# Altium schematic sheet Logic.SchDoc
size C; SheetNumber: 7; SheetTotal: 8
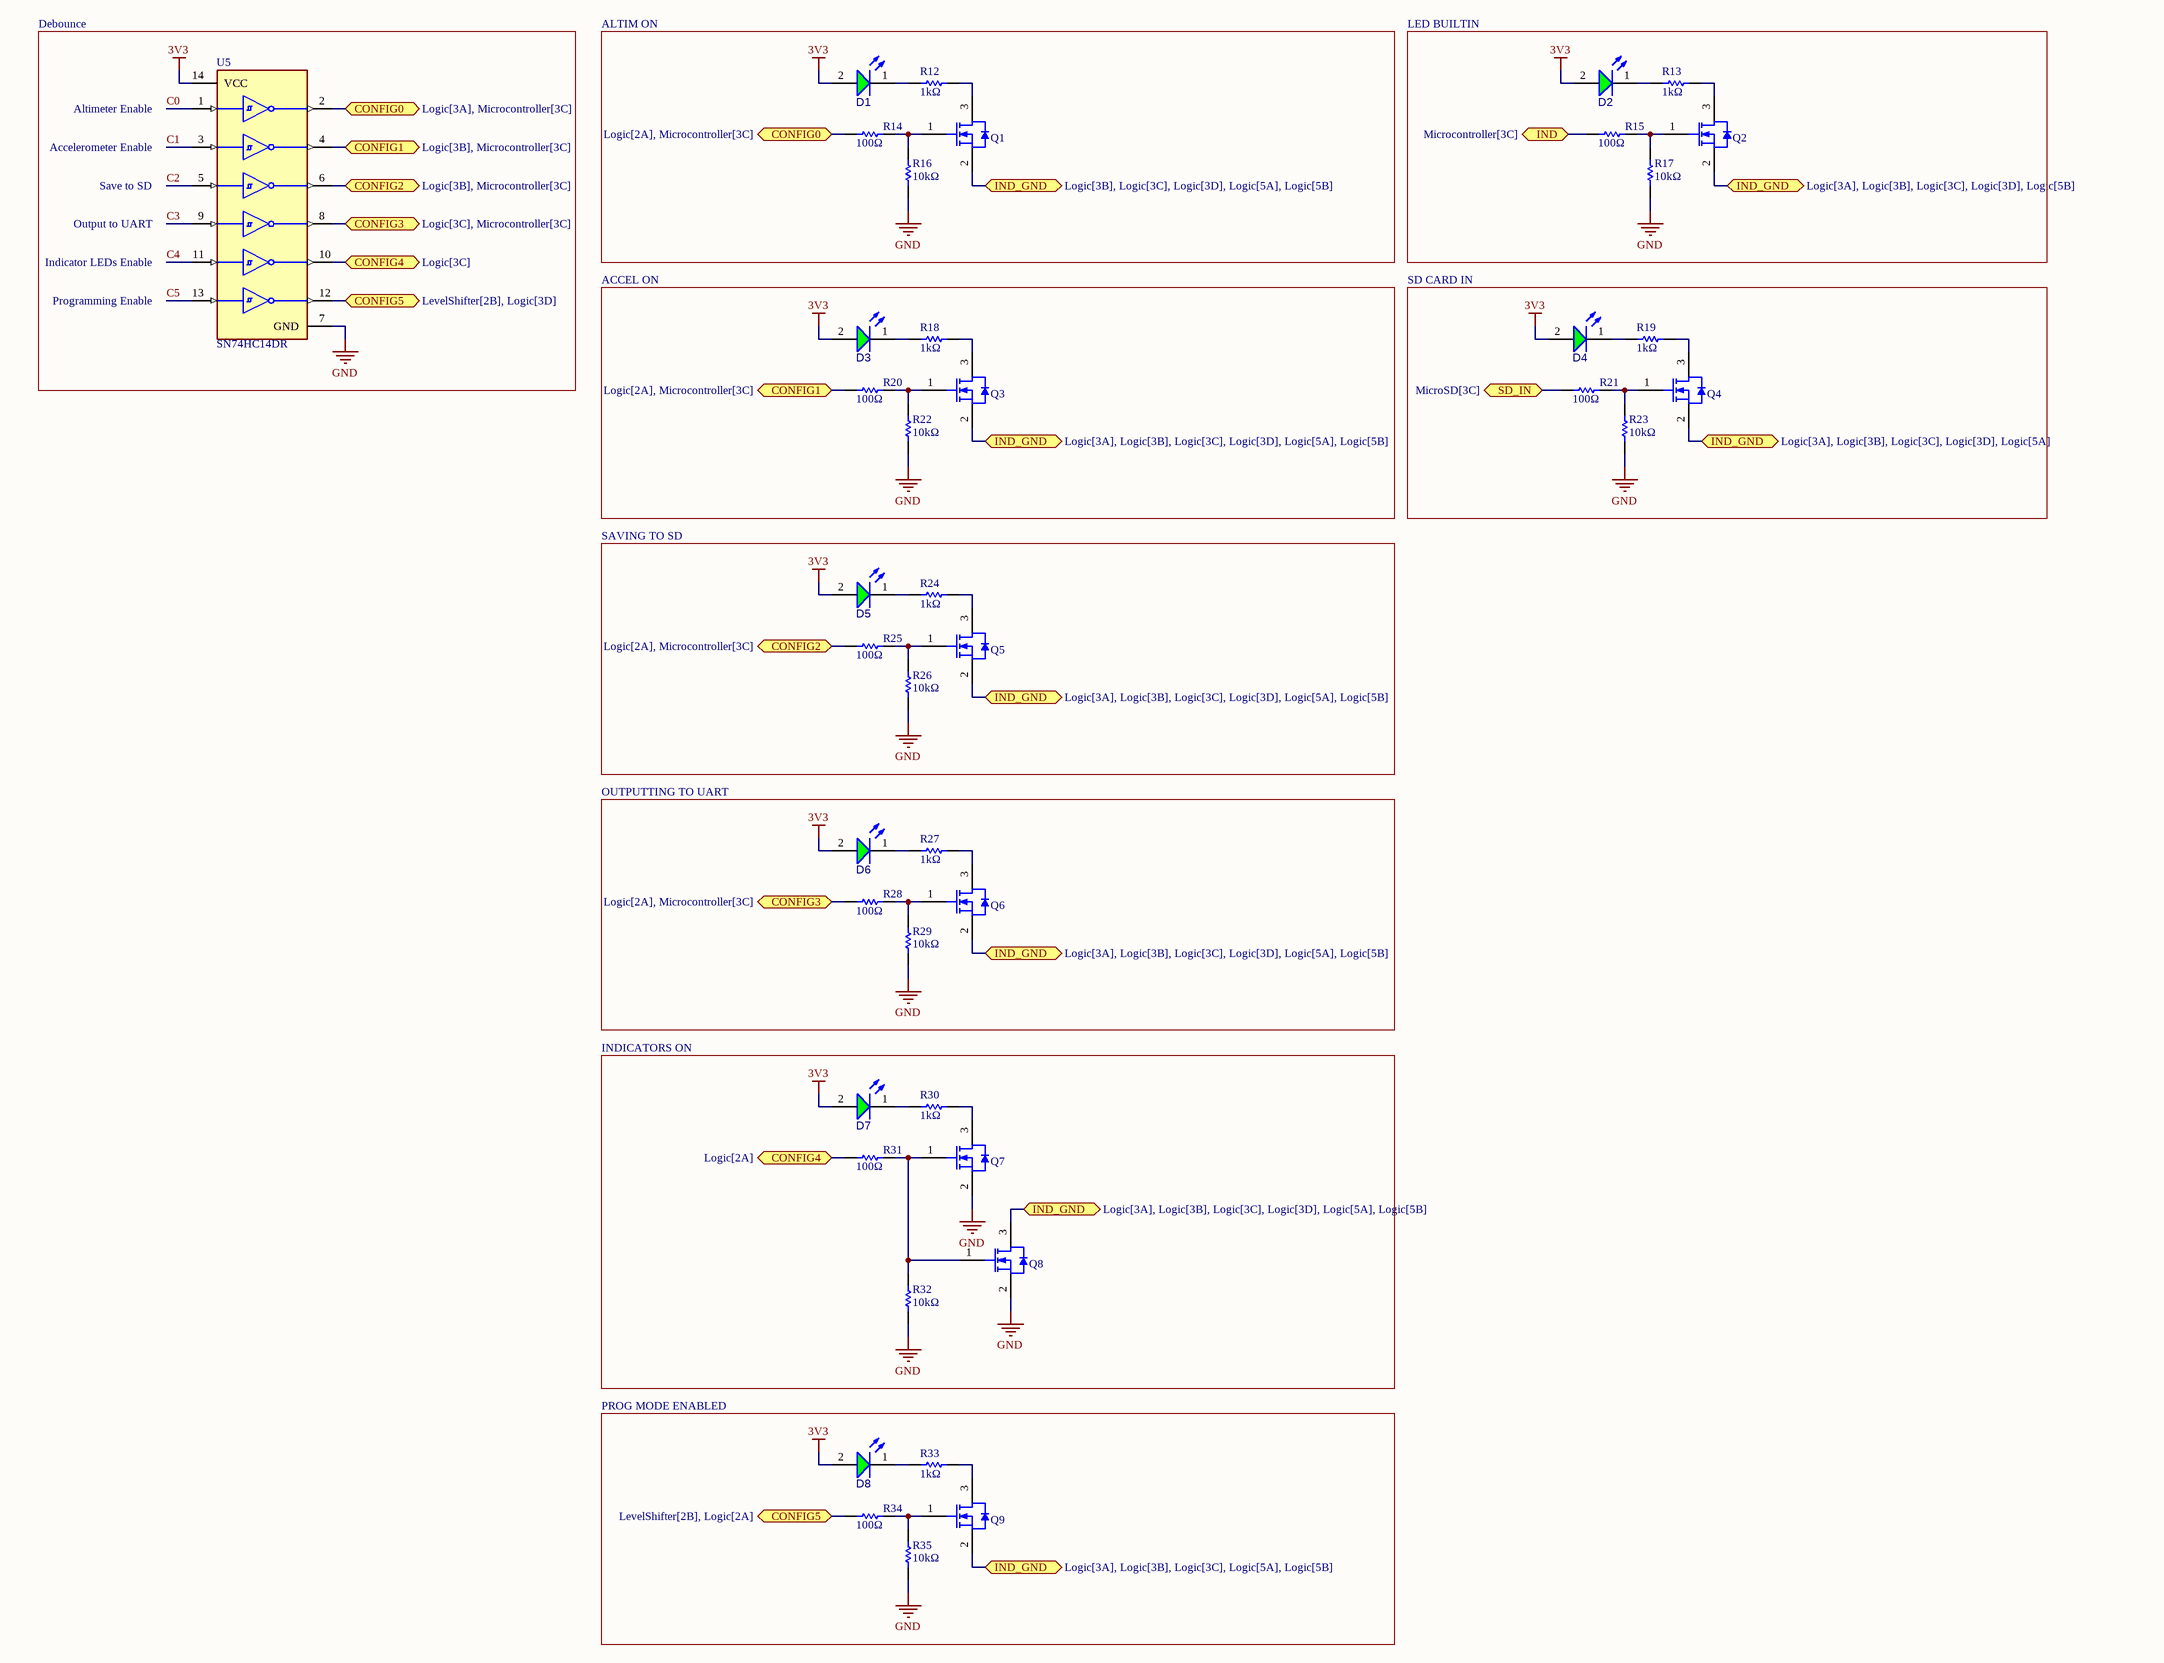
[diagram p0: Logic.SchDoc]

## Parts
D1  150120GS75000  [WL-SMCW_1206_150120xx75000]  (value not drawn)
D2  150120GS75000  [WL-SMCW_1206_150120xx75000]  (value not drawn)
D3  150120GS75000  [WL-SMCW_1206_150120xx75000]  (value not drawn)
D4  150120GS75000  [WL-SMCW_1206_150120xx75000]  (value not drawn)
D5  150120GS75000  [WL-SMCW_1206_150120xx75000]  (value not drawn)
D6  150120GS75000  [WL-SMCW_1206_150120xx75000]  (value not drawn)
D7  150120GS75000  [WL-SMCW_1206_150120xx75000]  (value not drawn)
D8  150120GS75000  [WL-SMCW_1206_150120xx75000]  (value not drawn)
Q1  IRLML2502TRPBF  [INTR-SOT-23-3_V]  (value not drawn)
Q2  IRLML2502TRPBF  [INTR-SOT-23-3_V]  (value not drawn)
Q3  IRLML2502TRPBF  [INTR-SOT-23-3_V]  (value not drawn)
Q4  IRLML2502TRPBF  [INTR-SOT-23-3_V]  (value not drawn)
Q5  IRLML2502TRPBF  [INTR-SOT-23-3_V]  (value not drawn)
Q6  IRLML2502TRPBF  [INTR-SOT-23-3_V]  (value not drawn)
Q7  IRLML2502TRPBF  [INTR-SOT-23-3_V]  (value not drawn)
Q8  IRLML2502TRPBF  [INTR-SOT-23-3_V]  (value not drawn)
Q9  IRLML2502TRPBF  [INTR-SOT-23-3_V]  (value not drawn)
R12  1kΩ  [RESC3116X65X40LL10T20]
R13  1kΩ  [RESC3116X65X40LL10T20]
R14  100Ω  [RESC3116X65X40LL10T20]
R15  100Ω  [RESC3116X65X40LL10T20]
R16  10kΩ  [RESC3116X65X40LL10T20]
R17  10kΩ  [RESC3116X65X40LL10T20]
R18  1kΩ  [RESC3116X65X40LL10T20]
R19  1kΩ  [RESC3116X65X40LL10T20]
R20  100Ω  [RESC3116X65X40LL10T20]
R21  100Ω  [RESC3116X65X40LL10T20]
R22  10kΩ  [RESC3116X65X40LL10T20]
R23  10kΩ  [RESC3116X65X40LL10T20]
R24  1kΩ  [RESC3116X65X40LL10T20]
R25  100Ω  [RESC3116X65X40LL10T20]
R26  10kΩ  [RESC3116X65X40LL10T20]
R27  1kΩ  [RESC3116X65X40LL10T20]
R28  100Ω  [RESC3116X65X40LL10T20]
R29  10kΩ  [RESC3116X65X40LL10T20]
R30  1kΩ  [RESC3116X65X40LL10T20]
R31  100Ω  [RESC3116X65X40LL10T20]
R32  10kΩ  [RESC3116X65X40LL10T20]
R33  1kΩ  [RESC3116X65X40LL10T20]
R34  100Ω  [RESC3116X65X40LL10T20]
R35  10kΩ  [RESC3116X65X40LL10T20]
U5  SN74HC14DR  [FP-D0014A-IPC_C]

## Blocks framed on the sheet
ALTIM ON: D1 Q1 R12 R14 R16
LED BUILTIN: D2 Q2 R13 R15 R17
ACCEL ON: D3 Q3 R18 R20 R22
SD CARD IN: D4 Q4 R19 R21 R23
SAVING TO SD: D5 Q5 R24-R26
OUTPUTTING TO UART: D6 Q6 R27-R29
INDICATORS ON: D7 Q7 Q8 R30-R32
PROG MODE ENABLED: D8 Q9 R33-R35

## Ports
CONFIG0 (bidir, see Logic[2A], Microcontroller[3C]), CONFIG0 (bidir, see Logic[3A], Microcontroller[3C]), CONFIG1 (bidir, see Logic[2A], Microcontroller[3C]), CONFIG1 (bidir, see Logic[3B], Microcontroller[3C]), CONFIG2 (bidir, see Logic[2A], Microcontroller[3C]), CONFIG2 (bidir, see Logic[3B], Microcontroller[3C]), CONFIG3 (bidir, see Logic[2A], Microcontroller[3C]), CONFIG3 (bidir, see Logic[3C], Microcontroller[3C]), CONFIG4 (bidir, see Logic[2A]), CONFIG4 (bidir, see Logic[3C]), CONFIG5 (bidir, see LevelShifter[2B], Logic[2A]), CONFIG5 (bidir, see LevelShifter[2B], Logic[3D]), IND (bidir, see Microcontroller[3C]), IND_GND (bidir, see Logic[3A], Logic[3B], Logic[3C], Logic[3D], Logic[5A]), IND_GND (bidir, see Logic[3A], Logic[3B], Logic[3C], Logic[3D], Logic[5A], Logic[5B]), IND_GND (bidir, see Logic[3A], Logic[3B], Logic[3C], Logic[3D], Logic[5B]), IND_GND (bidir, see Logic[3A], Logic[3B], Logic[3C], Logic[5A], Logic[5B]), IND_GND (bidir, see Logic[3B], Logic[3C], Logic[3D], Logic[5A], Logic[5B]), SD_IN (bidir, see MicroSD[3C])

## Nets
3V3: D1.2(A) D2.2(A) D3.2(A) D4.2(A) D5.2(A) D6.2(A) D7.2(A) D8.2(A) U5.14(VCC)
GND: Q7.2(S) Q8.2(S) R16.1 R17.1 R22.1 R23.1 R26.1 R29.1 R32.1 R35.1 U5.7(GND)
C0: U5.1(1A)
C1: U5.3(2A)
C2: U5.5(3A)
C3: U5.9(4A)
C4: U5.11(5A)
C5: U5.13(6A)
CONFIG0: R14.1 U5.2(1Y) ; port CONFIG0
CONFIG1: R20.1 U5.4(2Y) ; port CONFIG1
CONFIG2: R25.1 U5.6(3Y) ; port CONFIG2
CONFIG3: R28.1 U5.8(4Y) ; port CONFIG3
CONFIG4: R31.1 U5.10(5Y) ; port CONFIG4
CONFIG5: R34.1 U5.12(6Y) ; port CONFIG5
IND: R15.1 ; port IND
IND_GND: Q1.2(S) Q2.2(S) Q3.2(S) Q4.2(S) Q5.2(S) Q6.2(S) Q8.3(D) Q9.2(S) ; port IND_GND
SD_IN: R21.1 ; port SD_IN
NetD1_1: D1.1(K) R12.2
NetD2_1: D2.1(K) R13.2
NetD3_1: D3.1(K) R18.2
NetD4_1: D4.1(K) R19.2
NetD5_1: D5.1(K) R24.2
NetD6_1: D6.1(K) R27.2
NetD7_1: D7.1(K) R30.2
NetD8_1: D8.1(K) R33.2
NetQ1_1: Q1.1(G) R14.2 R16.2
NetQ1_3: Q1.3(D) R12.1
NetQ2_1: Q2.1(G) R15.2 R17.2
NetQ2_3: Q2.3(D) R13.1
NetQ3_1: Q3.1(G) R20.2 R22.2
NetQ3_3: Q3.3(D) R18.1
NetQ4_1: Q4.1(G) R21.2 R23.2
NetQ4_3: Q4.3(D) R19.1
NetQ5_1: Q5.1(G) R25.2 R26.2
NetQ5_3: Q5.3(D) R24.1
NetQ6_1: Q6.1(G) R28.2 R29.2
NetQ6_3: Q6.3(D) R27.1
NetQ7_1: Q7.1(G) Q8.1(G) R31.2 R32.2
NetQ7_3: Q7.3(D) R30.1
NetQ9_1: Q9.1(G) R34.2 R35.2
NetQ9_3: Q9.3(D) R33.1

## Notes on the sheet
- Debounce
- Altimeter Enable
- Accelerometer Enable
- Save to SD
- Output to UART
- Indicator LEDs Enable
- Programming Enable

## Library data of the parts
D1-D8 = CMP-1426-00014-4: WL-SMCW SMT Mono-Color Chip LED Waterclear; Dominant Wavelength: 525nm; Reverse Voltage: 5V; Max Junction Temperature (Tj): 95°C; Lens Style: Clear, Rectangular; Forward Voltage: 3.2V; Power Dissipation: 105mW; Peak Wavelength: 515nm; Test Current: 20mA; Color: Green; Forward Current: 100mA; Luminous Intensity: 450mcd; Viewing Angle: 140°; Case Code (Imperial): 1206; REACH SVHC: Unknown; Packaging: Tape and Reel; Max Operating Temperature: 85°C; Case/Package: 1206; Height: 680µm; Length: 3.2mm; Mount: Surface Mount; Min Operating Temperature: -40°C; Width: 1.6mm; Case Code (Metric): 3216; Max Reverse Voltage (DC): 5V; RoHS: Compliant; Wavelength: 525nm
Q1-Q9 = CMP-2000-04985-1: N-Channel HEXFET(R) Power MOSFET, 20 V VDS, +/- 12 V VGS, 4.2 A, 3-Pin SOT23, RoHS, Tape and Reel; Manufacturer: International Rectifier; Drain-to-Source Voltage [Vdss]: 20V; Drain-Source On Resistance-Max: 0.045O; Qg Gate Charge: 8nC; Rated Power Dissipation: 1.25W; Package Reference: SOT-23-3; Manufacturer URL: http://internationalrectifier.com/; Package Description: 3-Pin Small Outline Transistor, Body 2.92 x 1.3 mm, Pitch 0.95 mm; Datasheet Version: Apr-14; Channel Type: N-Channel; Datasheet URL: https://datasheet.ciiva.com/6383/irlml2502pbf-6383216.pdf
R12 R13 R18 R19 R24 R27 R30 R33 = CMP-2100-03678-1: Chip Resistor, 1 KOhm, +/- 1%, 0.25 W, -55 to 155 degC, 1206 (3216 Metric), RoHS, Tape and Reel; Manufacturer: Yageo; Temperature Coefficient: 100ppm/degreesC; Power Rating: 250mW; Voltage Rating: 200V; Resistance: 1KOhm; Composition: ThickFilm; Min Operating Temperature: -55degC; Tolerance: 1%; REACH SVHC: Unknown; Case Code (Metric): 3216; Military Standard: Not; Datasheet Version: Rev. 5, 10/2016; Package Reference: 1206.0; Case/Package: 1206; Length: 3.1mm; Manufacturer URL: http://www.yageo.com/; Lead Free: LeadFree; RoHSCompliant: true; Termination: SMD/SMT; Packaging: TapeandReel; Package Description: 2-Pin Surface Mount Device, Body 3.1 x 1.6 mm; Depth: 1.6mm; Case Code (Imperial): 1206; Max Operating Temperature: 155degC; Datasheet URL: http://www.yageo.com/NewPortal/yageodocoutput?fileName=/pdf/R-Chip/PYu-RC_Group_51_RoHS_L_5.pdf; Height: 0.55mm
R14 R15 R20 R21 R25 R28 R31 R34 = CMP-2100-03675-1: Chip Resistor, 100 Ohm, +/- 1%, 0.25 W, -55 to 155 degC, 1206 (3216 Metric), RoHS, Tape and Reel; Manufacturer: Yageo; Voltage Rating: 200V; Power Rating: 250mW; Resistance: 100Ohm; Temperature Coefficient: 100ppm/degreesC; Case Code (Imperial): 1206; Datasheet Version: Rev. 5, 10/2016; Case Code (Metric): 3216; Packaging: TapeandReel; Composition: ThickFilm; Height: 0.55mm; Lead Free: LeadFree; Depth: 1.6mm; Package Reference: 1206.0; Termination: SMD/SMT; Case/Package: 1206; Package Quantity: 5000; Datasheet URL: http://www.yageo.com/NewPortal/yageodocoutput?fileName=/pdf/R-Chip/PYu-RC_Group_51_RoHS_L_5.pdf; REACH SVHC: Unknown; Max Operating Temperature: 155degC; Length: 3.1mm; Manufacturer URL: http://www.yageo.com/; Min Operating Temperature: -55degC; Tolerance: 1%; RoHSCompliant: true; Width: 1.6mm; Package Description: 2-Pin Surface Mount Device, Body 3.1 x 1.6 mm
R16 R17 R22 R23 R26 R29 R32 R35 = CMP-1014-00623-2: Chip Resistor, 10 KOhm, +/- 1%, 0.25 W, -55 to 155 degC, 1206 (3216 Metric), RoHS, Tape and Reel; Manufacturer: Yageo; Voltage Rating: 200V; Resistance: 10KOhm; Temperature Coefficient: 100ppm/degreesC; Power Rating: 250mW; Packaging: TapeandReel; Termination: SMD/SMT; REACH SVHC: Unknown; Tolerance: 1%; Height: 0.55mm; Composition: ThickFilm; Max Operating Temperature: 155degC; Datasheet Version: Rev. 5, 10/2016; Lead Free: LeadFree; Case Code (Metric): 3216; Depth: 1.6mm; Package Quantity: 5000; RoHSCompliant: true; Military Standard: Not; Case/Package: 1206; Case Code (Imperial): 1206; Min Operating Temperature: -55degC; Datasheet URL: http://www.yageo.com/NewPortal/yageodocoutput?fileName=/pdf/R-Chip/PYu-RC_Group_51_RoHS_L_5.pdf; Length: 3.1mm; Manufacturer URL: http://www.yageo.com/; Package Reference: 1206.0; Width: 1.6mm; Package Description: 2-Pin Surface Mount Device, Body 3.1 x 1.6 mm
U5 = CMP-1615-00273-4: IC INVERTER SCHMITT 6CH 14SOIC; Logic Function: Buffer; Max Supply Voltage: 6V; Propagation Delay: 155ns; Number of Elements: 6; Quiescent Current: 2uA; Number of Inputs: 1; High Level Output Current: -5.2mA; Turn-On Delay Time: 31ns; Min Supply Voltage: 2V; Low Level Output Current: 5.2mA; Operating Supply Voltage: 5V; Input Type: SCHMITT TRIGGER; Schmitt Trigger Input: Yes; REACH SVHC: No SVHC; Series: 74HC; Width: 3.91mm; Number of Pins: 14; Max Operating Temperature: 85°C; Length: 8.65mm; Radiation Hardening: No; Technology: CMOS; Number of Bits: 6; Case/Package: SOIC; Package Quantity: 2500; Number of Gates: 6; Lead Free: Lead Free; Number of Circuits: 6; Output Current: 5.2mA; Height: 1.58mm; Min Operating Temperature: -40°C; Contact Plating: Gold; RoHS Compliant: Yes; Weight: 0.004318oz; Mount: Surface Mount; Packaging: Tape and Reel